# Altium schematic sheet ZeroCrossDetector.SchDoc: Zero-Crossing Detector
size A4; DrawnBy: J.F.B.; Revision: 2; SheetNumber: 1; SheetTotal: 1
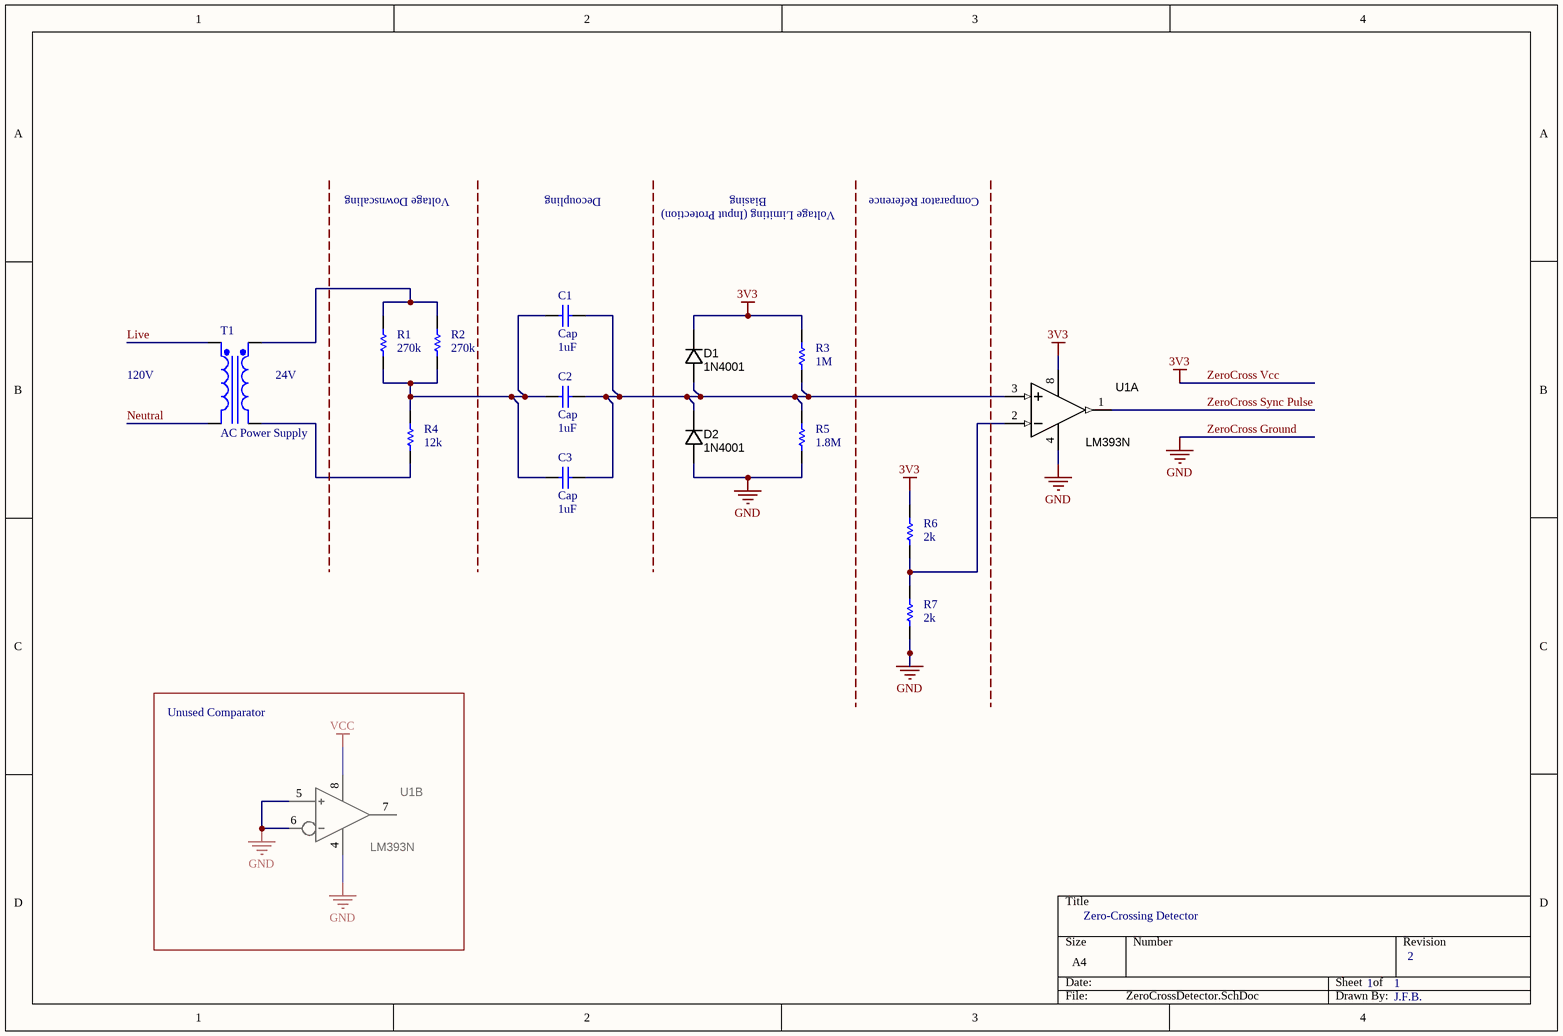
[diagram p0: ZeroCrossDetector.SchDoc]

## Parts
C1  Cap  value 1uF  [RAD-0.3]
C2  Cap  value 1uF  [RAD-0.3]
C3  Cap  value 1uF  [RAD-0.3]
D1  1N4001  [DO-41]
D2  1N4001  [DO-41]
R1  value 270k  [AXIAL-0.3]
R2  value 270k  [AXIAL-0.3]
R3  value 1M  [AXIAL-0.3]
R4  value 12k  [AXIAL-0.3]
R5  value 1.8M  [AXIAL-0.3]
R6  value 2k  [AXIAL-0.3]
R7  value 2k  [AXIAL-0.3]
T1  AC Power Supply  [TRF_4]
U1  LM393N  (parts A,B of 2)

## Blocks framed on the sheet
Unused Comparator: U1

## Nets
VCC: U1.8(+Vs)
ZeroCross Ground: D2.A R5.1 R7.1 U1.4(-Vs) U1.5(CIN_+) U1.6(CIN-)  [also labelled GND]
ZeroCross Vcc: D1.K R3.2 R6.2 U1.8(+Vs)  [also labelled 3V3]
Live: T1.1(Pri+)
Neutral: T1.2(Pri-)
ZeroCross Sync Pulse: U1.1(Aout)
NetC1_1: C1.1 C2.1 C3.1 R1.1 R2.1 R4.2
NetC1_2: C1.2 C2.2 C3.2 D1.A D2.K R3.1 R5.2 U1.3(AIN_+)
NetR1_2: R1.2 R2.2 T1.3(Sec+)
NetR4_1: R4.1 T1.4(Sec-)
NetR6_1: R6.1 R7.2 U1.2(AIN_-)

Not connected (* = marked no-connect by the designer): U1 7(Cout)

## Notes on the sheet
- Voltage Downscaling
- Decoupling
- Biasing
- Voltage Limiting (Input Protection)
- Comparator Reference
- 120V
- (near T1) 24V

## Library data of the parts
C1-C3 = Cap: Capacitor; Published: 8-Jun-2000; LatestRevisionDate: 17-Jul-2002; LatestRevisionNote: Re-released for DXP Platform.; PackageReference: RAD-0.3; Publisher: Altium Limited; PackageDescription: Radial Cap, Thru-Hole; 2 Leads; 0.3 in Pin Spacing
D1 D2 = DIODE_1N4007_1000V_1.0A_DO-41: Diode 1N4007 1A 1000V THD; Manufacturer 1: Diodes Inc; Manufacturer Part Number 1: 1N4007-T; Ratings: 100V; 1.5A; Diode Type: Standard; Value: Vf = 1.15V @ 1.5A (Max); SCDType: spec; Package / Case: DO-41; Mounting Type: Through Hole
R1-R7 = Res1: Resistor; Published: 8-Jun-2000; LatestRevisionDate: 17-Jul-2002; LatestRevisionNote: Re-released for DXP Platform.; PackageReference: AXIAL-0.3; Publisher: Altium Limited; PackageDescription: Axial Device, Thru-Hole; 2 Leads; 0.3 in Pin Spacing
T1 = Trans Ideal: Transformer (Ideal); Published: 8-Jun-2000; LatestRevisionDate: 17-Jul-2002; LatestRevisionNote: Re-released for DXP Platform.; PackageReference: TRF_4; Publisher: Altium Limited; PackageDescription: Transformer; 4 Leads
U1 = IC_AMP+COMPAR_TLV2702: Fairchild LM393N Comparator; Manufacturer 1: Fairchild Semiconductor; Voltage - Supply: 2 V ~ 36 V, ±1 V ~ 18 V; SCDType: undef; Manufacturer Part Number 1: LM393N; Package / Case: 8-DIP; Supplier 1: Digi-Key; Supplier Part Number 1: LM393NFS-ND